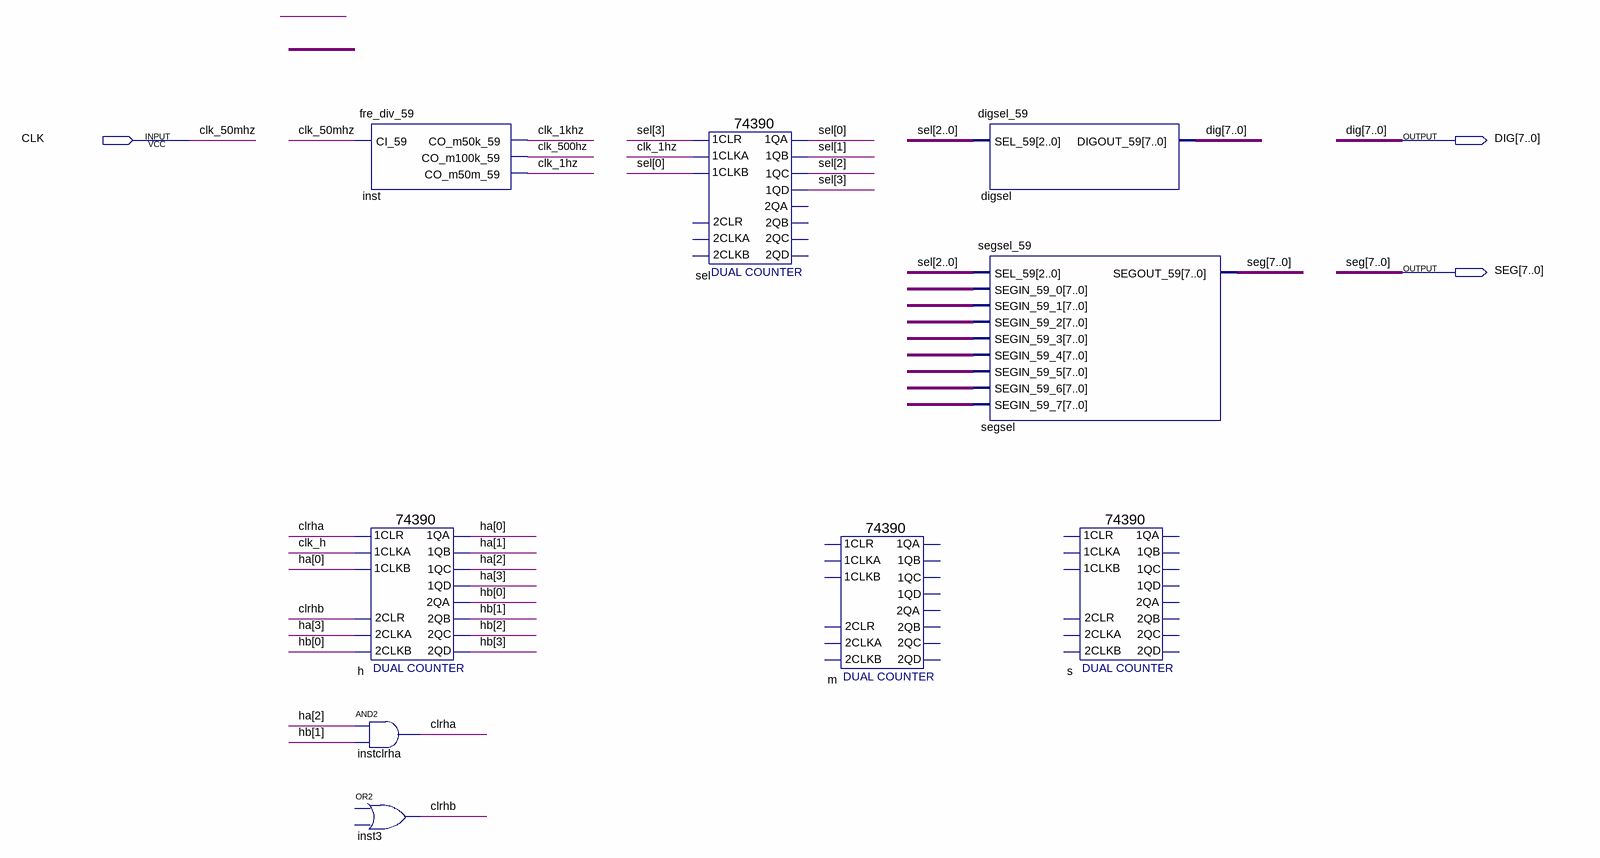
[diagram p0: schematic sheet]
// Quartus schematic clock_59.bdf as structural Verilog: 9 symbols, 3 pins
module clock_59 (
  input  CLK,
  output [7:0] DIG,
  output [7:0] SEG
);

  wire clk_1hz, clk_1khz, clk_500hz, clk_h, clrha, clrhb;
  wire [3:0] ha, hb, sel;
  wire [7:0] undriven, undriven_2, undriven_3, undriven_4, undriven_5, undriven_6, undriven_7, undriven_8;

  fre_div_59 inst (.CI_59(CLK), .CO_m50k_59(clk_1khz), .CO_m100k_59(clk_500hz), .CO_m50m_59(clk_1hz));
  \74390  h (
    .\2CLKA (ha[3]), .\2CLR (clrhb), .\2CLKB (hb[0]), .\1CLR (clrha), .\1CLKA (clk_h), .\1CLKB (ha[0]),
    .\1QA (ha[0]), .\1QB (ha[1]), .\1QC (ha[2]), .\1QD (ha[3]), .\2QA (hb[0]), .\2QB (hb[1]), .\2QC (hb[2]),
    .\2QD (hb[3]));
  and instclrha (clrha, ha[2], hb[1]);
  // OR2 inst3 has open pins: IN1=open, IN2=open, OUT=clrhb
  \74390  u_sel (
    .\1CLR (sel[3]), .\1CLKA (clk_1hz), .\1CLKB (sel[0]), .\1QA (sel[0]), .\1QB (sel[1]), .\1QC (sel[2]),
    .\1QD (sel[3]));  // open: 2CLKA, 2CLR, 2CLKB, 2QA, 2QB, 2QC, 2QD
  \74390  m ();  // open: 2CLKA, 2CLR, 2CLKB, 1CLR, 1CLKA, 1CLKB, 1QA, 1QB, 1QC, 1QD, 2QA, 2QB, 2QC, 2QD
  digsel_59 digsel (.SEL_59(sel[2:0]), .DIGOUT_59(DIG));
  segsel_59 segsel (
    .SEL_59(sel[2:0]), .SEGIN_59_0(undriven), .SEGIN_59_1(undriven_2), .SEGIN_59_2(undriven_3),
    .SEGIN_59_3(undriven_4), .SEGIN_59_4(undriven_5), .SEGIN_59_5(undriven_6), .SEGIN_59_6(undriven_7),
    .SEGIN_59_7(undriven_8), .SEGOUT_59(SEG));
  \74390  s ();  // open: 2CLKA, 2CLR, 2CLKB, 1CLR, 1CLKA, 1CLKB, 1QA, 1QB, 1QC, 1QD, 2QA, 2QB, 2QC, 2QD

  // Other names for the same wires on the sheet: clk_50mhz = CLK
endmodule
